# Altium schematic sheet Sound.SchDoc
size A4; SheetNumber: 1; SheetTotal: 4
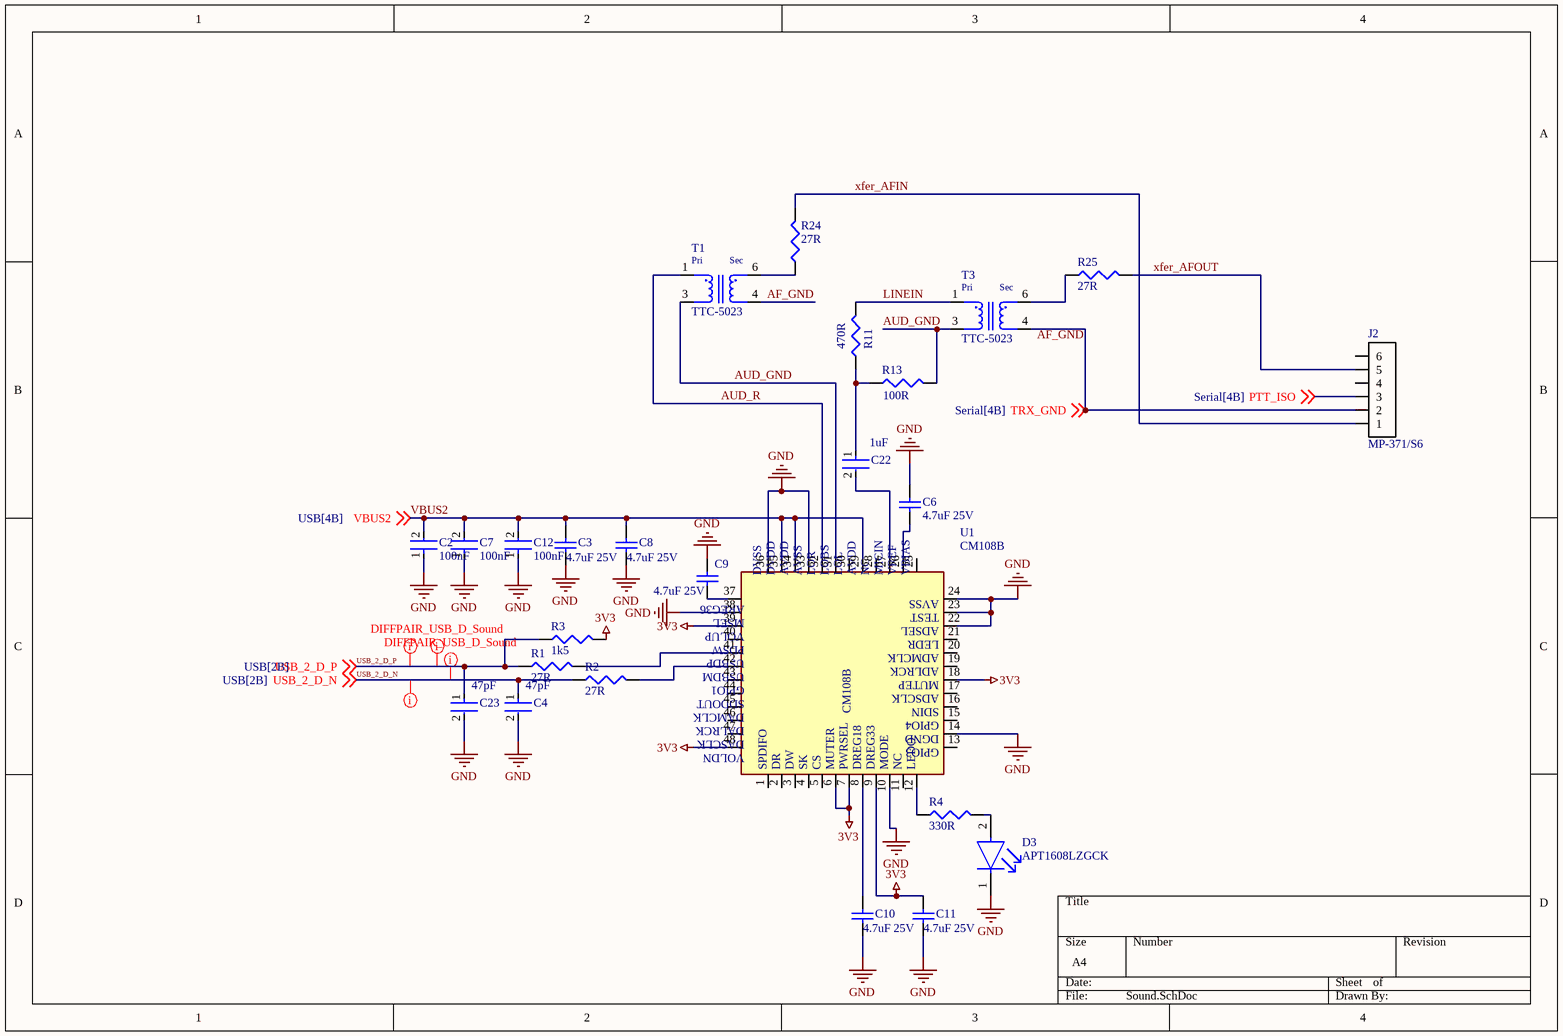
[diagram p0: Sound.SchDoc]

## Parts
C2  Capacitance: 100nF  [FP-CL10-IPC_B]  (hidden comment: CL10B104KC8NNNC)
C3  4.7uF 25V  [CAPC1210(3225)220_M]
C4  Capacitance: 47pF  [FP-CL10-IPC_C]  (hidden comment: CL10C470JC8NNNC)
C6  4.7uF 25V  [CAPC1210(3225)220_M]
C7  Capacitance: 100nF  [FP-CL10-IPC_B]  (hidden comment: CL10B104KC8NNNC)
C8  4.7uF 25V  [CAPC1210(3225)220_M]
C9  4.7uF 25V  [CAPC1210(3225)220_M]
C10  4.7uF 25V  [CAPC1210(3225)220_M]
C11  4.7uF 25V  [CAPC1210(3225)220_M]
C12  Capacitance: 100nF  [FP-CL10-IPC_B]  (hidden comment: CL10B104KC8NNNC)
C22  Capacitance: 1uF  [FP-CC0603-DB-MFG]  (hidden comment: CC0603KRX7R9BB105)
C23  Capacitance: 47pF  [FP-CL10-IPC_C]  (hidden comment: CL10C470JC8NNNC)
D3  APT1608LZGCK  [FP-APT1608LZGCK-MFG]
J2  MP-371/S6  [MiniDIN6_TopSolder_Lumberg]
R1  27R  [J1-0603]
R2  27R  [J1-0603]
R3  1k5  [J1-0603]
R4  330R  [J1-0603]
R11  470R  [J1-0603]
R13  100R  [J1-0603]
R24  27R  [J1-0603]
R25  27R  [J1-0603]
T1  TTC-5023  [TRANSFORMER_TTC-5023]
T3  TTC-5023  [TRANSFORMER_TTC-5023]
U1  CM108B  [TQFP48]

## Nets
3V3: C11.2 R3.2 U1.6 U1.7 U1.9 U1.18 U1.39 U1.48
GND: C2.1 C3.1 C4.2 C6.1 C7.1 C8.1 C9.2 C10.1 C11.1 C12.1 C23.2 D3.1(C) U1.10 U1.14 U1.22 U1.23 U1.24 U1.33 U1.36 U1.38
AF_GND: J2.2 T1.4 T3.4 ; off-sheet TRX_GND  [also labelled TRX_GND]
AUD_GND: R13.2 T1.3 T3.3 U1.31
AUD_R: T1.1 U1.32
LINEIN: R11.2 T3.1
PTT_ISO: J2.3 ; off-sheet PTT_ISO
USB_2_D_N: C4.1 R2.1 ; off-sheet USB_2_D_N
USB_2_D_P: C23.1 R1.1 R3.1 ; off-sheet USB_2_D_P
VBUS2: C2.2 C3.2 C7.2 C8.2 C12.2 U1.29 U1.34 U1.35 ; off-sheet VBUS2
xfer_AFIN: J2.1 R24.2
xfer_AFOUT: J2.5 R25.2
NetC6_2: C6.2 U1.26
NetC9_1: C9.1 U1.37
NetC10_2: C10.2 U1.8
NetC22_1: C22.1 R11.1 R13.1
NetC22_2: C22.2 U1.27
NetD3_2: D3.2(A) R4.2
NetR1_2: R1.2 U1.41
NetR2_2: R2.2 U1.42
NetR4_1: R4.1 U1.12
NetR24_1: R24.1 T1.6
NetR25_1: R25.1 T3.6

Not connected (* = marked no-connect by the designer): J2 4 6; U1 1 2 3 4 5 11 13 15 16 17 19 20 21 25 28 30 40 43 44 45 46 47

## Layout directives
net class USB_Diff: USB_2_D_N, USB_2_D_P
differential pair: USB_2_D_N, USB_2_D_P

## Notes on the sheet
- (in symbol CMP-002-000000-1) DVSS; DVDD; AVDD; AVSS; LOR; LOBS; LOL; NC; MICIN; VREF; VBIAS; AREG36; MSEL; TEST; VOLUP; ADSEL; PDSW; LEDR; USBDP; ADMCLK; USBDM; ADLRCK; GPIO1; MUTEP; SDDOUT; ADSCLK; DAMCLK; SDIN; DALRCK; GPIO4; DASCLK; DGND; VOLDN; GPIO3; SPDIFO; DR; DW; SK; CS; MUTER; PWRSEL; DREG18; DREG33; MODE; LEDO
- (in symbol CMP-012-00000-1) Pri; Sec

## Library data of the parts
C2 C7 C12 = CMP-13271-004036-1: Cap Ceramic 100nF 100V X7R ±10% Pad SMD 0603 +125°C T/R; Mount: Surface Mount; Packaging: Cut Tape; Width: 0.031inch; Thickness: 0.035inch; Length: 0.063inch; Tolerance: 10%; Min Operating Temperature: -55°C; Case/Package: 0603; Voltage Rating: 100V; Max Operating Temperature: 125°C; Case Code (Metric): 1608; Case Code (Imperial): 0603; JLCPCBPartNum: C15725
C3 C6 C8-C11 = CMP-1038-02151-2: CAP 4.7uF 25V ±10% 1210 (3225 Metric) Thickness 2.2mm SMD; Case-Metric: 3225; Case-EIA: 1210; Tolerance: Â±10%; Value: 4.7uF; Technology: SMT; Max Thickness: 2.2 mm; Rated Voltage: 25 V; JLCPCBPartNum: C86052
C4 C23 = CMP-13271-001416-1: Cap Ceramic 47pF 100V C0G ±5% Pad SMD 0603 +125°C T/R; Tolerance: 5%; Packaging: Tape and Reel; Thickness: 0.035inch; Dielectric: C0G; Max Operating Temperature: 125°C; Radiation Hardening: No; Width: 0.031inch; Height: 0.8mm; Voltage Rating: 100V; Case Code (Imperial): 0603; Voltage Rating (DC): 100V; Case/Package: 0603; Case Code (Metric): 1608; Min Operating Temperature: -55°C; Material: Ceramic; Length: 1.6mm; Mount: Surface Mount; Depth: 0.8mm; JLCPCBPartNum: C1671
C22 = CMP-03422-000761-2: CAP CER 1UF 50V X7R 0603; Tolerance: 10%; Lead Free: Lead Free; Max Operating Temperature: 125°C; Width: 0.031inch; Voltage Rating: 50V; Mount: Surface Mount; Resistor Type: Ceramic; Halogen Free: Halogen Free; Weight: 7.1E-05oz; Voltage Rating (DC): 50V; Package Quantity: 4000; Termination: SMD/SMT; Length: 0.063inch; Min Operating Temperature: -55°C; Dielectric: X7R; Case Code (Metric): 1608; Case Code (Imperial): 0603; Packaging: Tape and Reel; Thickness: 0.035inch; Case/Package: 0603; JLCPCBPartNum: C559769
D3 = CMP-44529-000040-1: LED GREEN CLEAR 2SMD; Dominant Wavelength: 525nm; Forward Voltage: 2.65V; Luminous Intensity: 50mcd; Test Current: 2mA; Viewing Angle: 120°; Lens Color: Colorless; Width: 0.8mm; Mount: Surface Mount; Lens Transparency: Clear; Length: 1.6mm; Packaging: Cut Tape; Case Code (Metric): 1608; Height: 0.75mm; Case/Package: 0603; Case Code (Imperial): 0603; Color: Green; JLCPCBPartNum: C1322302
J2 = MiniDin6_SMT: Miniature circular connectors MP-371/S6; Digikey_PartNum: 2057-MDP-006-ND
R1-R4 R11 R13 R24 R25 = Res3: Resistor; Published: 8-Jun-2000; LatestRevisionDate: 29-May-2009; LatestRevisionNote: IPC-7351 Footprint Added.; PackageReference: J1-0603; Publisher: Altium Limited; PackageDescription: Chip Resistor
  R1 R2 R24 R25: Value: 27R; JLCPCBPartNum: C192531
  R3: Value: 1k5; JLCPCBPartNum: C192164
  R4: Value: 330R; JLCPCBPartNum: C23138
  R11: Value: 470R; JLCPCBPartNum: C25804
  R13: Value: 100R; JLCPCBPartNum: C22775
T1 T3 = CMP-012-00000-1: 600 Impedance Primary Ohms 600 Impedance Secondary Ohms 1:1 Audio Transformer 200Hz ~ 4kHz Surface Mount; MF: Tamura; MP: TTC-5023; SnapEDA_Link: https://www.snapeda.com/parts/TTC-5023/Tamura/view-part/2878352/?ref=snap; Source: SnapEDAsch.SchLib; Design Item ID: TTC-5023; Pins: 4; Availability: Unavailable; Component Type: Standard; Price: None; Case/Package: Tamura; Value: *; JLCPCBPartNum: C840532
U1 = CMP-002-000000-1: USB Audio Codec improved on CM; MF: Cmedia; Check_prices: https://www.snapeda.com/parts/CM108B/Cmedia/view-part/424266/?ref=eda; Pin Count: 48; Source: CM108B.SchLib; Design Item ID: CM108B; Package: None; Price: None; Value: *; SnapEDA_Link: https://www.snapeda.com/parts/CM108B/Cmedia/view-part/424266/?ref=snap; MP: CM108B; Availability: Unavailable; Component Type: Interface; JLCPCBPartNum: C371347